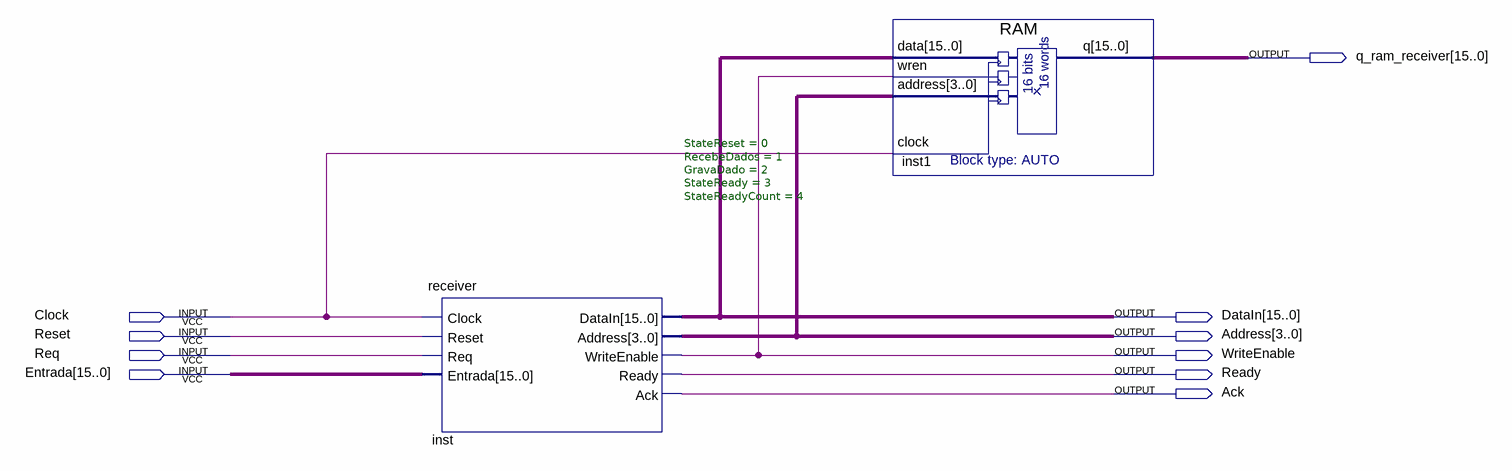
[diagram p0: schematic sheet]
// Quartus schematic module_receiver_bdf.bdf as structural Verilog: 2 symbols, 10 pins
module module_receiver_bdf (
  input  Clock,
  input  Reset,
  input  Req,
  input  [15:0] Entrada,
  output [15:0] q_ram_receiver,
  output [15:0] DataIn,
  output [3:0] Address,
  output WriteEnable,
  output Ready,
  output Ack
);

  receiver #(.StateReset(0), .RecebeDados(1), .GravaDado(2), .StateReady(3), .StateReadyCount(4)) inst (
    .Clock(Clock), .Reset(Reset), .Req(Req), .Entrada(Entrada), .DataIn(DataIn), .Address(Address),
    .WriteEnable(WriteEnable), .Ready(Ready), .Ack(Ack));
  RAM inst1 (.data(DataIn), .wren(WriteEnable), .address(Address), .clock(Clock), .q(q_ram_receiver));
endmodule
